# Altium schematic sheet power source.SchDoc
size A4
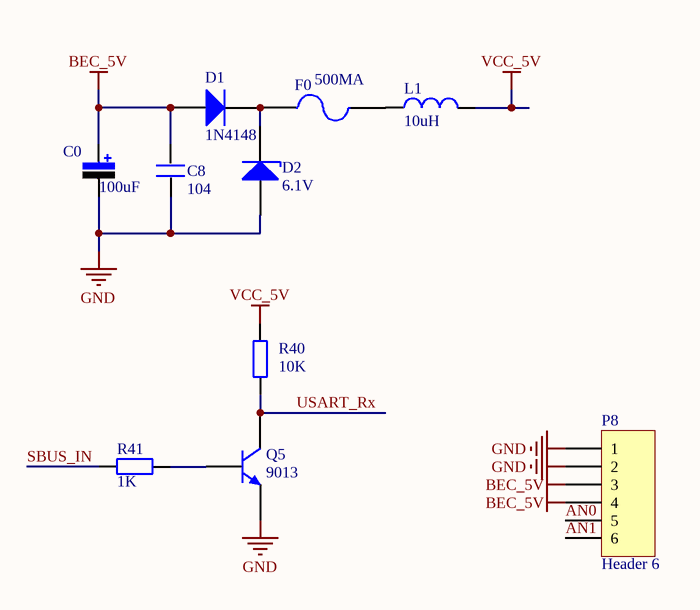
[diagram p0: power source.SchDoc]

## Parts
C0  value 100uF  [DIODE_SMC]  (hidden comment: Cap-Pol-ER)
C8  104  [0805]
D1  1N4148  [DIODE_SOP]
D2  value 6.1V  [DIODE_SOP]  (hidden comment: Diode-Z)
F0  500MA  [1812]
L1  value 10uH  [1206]  (hidden comment: Inductor)
P8  Header 6  [HDR1X6]
Q5  9013  [SOT23_L]
R40  value 10K  [0805]  (hidden comment: Res2)
R41  value 1K  [0805]  (hidden comment: Res2)

## Nets
BEC_5V: C0.1 C8.1 D1.1(A) P8.3 P8.4
GND: C0.2 C8.2 D2.1(A) P8.1 P8.2 Q5.3(C)
VCC_5V: L1.2 R40.2
AN0: P8.5
AN1: P8.6
SBUS_IN: R41.2
USART_Rx: Q5.1(E) R40.1
NetD1_2: D1.2(K) D2.2(K) F0.1
NetF0_2: F0.2 L1.1
NetQ5_2: Q5.2(B) R41.1

## Library data of the parts
C0 = Cap-Pol-ER: 插件电解电容; Published: 8-Jun-2000; LatestRevisionDate: 17-Jul-2002; LatestRevisionNote: Re-released for DXP Platform.; PackageReference: RB7.6-15; Publisher: Altium Limited
C8 = C
D1 = Diode: 二极管; Published: 8-Jun-2000; LatestRevisionDate: 17-Jul-2002; LatestRevisionNote: Re-released for DXP Platform.; PackageDocument: Sep-1996; PackageReference: SMC; Publisher: Altium Limited; Code_JEDEC: DO-214-AB
D2 = Diode-Z: 稳压二极管; Published: 8-Jun-2000; LatestRevisionDate: 17-Jul-2002; LatestRevisionNote: Re-released for DXP Platform.; PackageReference: SMB; Publisher: Altium Limited; Code_JEDEC: DO-214-AA
F0 = Fuse 2: Fuse; Published: 8-Jun-2000; LatestRevisionDate: 17-Jul-2002; LatestRevisionNote: Re-released for DXP Platform.; PackageReference: PIN-W2/E2.8; Publisher: Altium Limited; PackageDescription: Thru-Hole; 2 Leads
L1 = Inductor: 电感; Code_IEC: 1005; Published: 8-Jun-2000; LatestRevisionDate: 17-Jul-2002; LatestRevisionNote: Re-released for DXP Platform.; PackageReference: 0402-A; Publisher: Altium Limited; Code_JEITA: 0402
P8 = Header 6: Header, 6-Pin; LatestRevisionDate: 17-Jul-2002; LatestRevisionNote: Re-released for DXP Platform.; Publisher: Altium Limited
Q5 = 2N3904: NPN General Purpose Amplifier; pin to pad: 2>3 3>2; Published: 8-Jun-2000; LatestRevisionDate: 15-Jan-2003; LatestRevisionNote: PCB Footprint 'BCY-W3/D4.7' replaced; DatasheetVersion: 1997; PackageVersion: Sep-1998; PackageReference: TO-92A; Publisher: Altium Limited; PackageDescription: TO, Flat Index; 3 In-Line, Axial Leads; Body Dia. 4.5mm; Leads 0.51 x 0.48 mm (max); ComponentLink1Description: Manufacturer Link; ComponentLink1URL: http://www.fairchildsemi.com/; ComponentLink2Description: Datasheet; ComponentLink2URL: http://www.fairchildsemi.com/ds/2N%2F2N3904.pdf
R40 R41 = Res2: Resistor; Published: 8-Jun-2000; LatestRevisionDate: 17-Jul-2002; LatestRevisionNote: Re-released for DXP Platform.; PackageReference: AXIAL-0.4; Publisher: Altium Limited; PackageDescription: Axial Device, Thru-Hole; 2 Leads; 0.4 in Pin Spacing